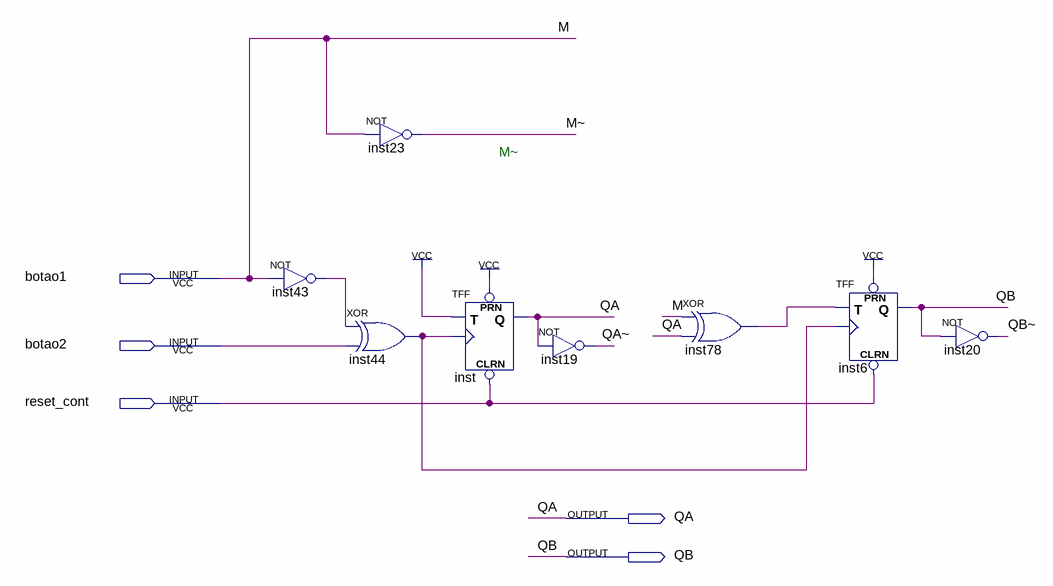
[diagram p0: schematic sheet]
// Quartus schematic Contador2bitsMENU.bdf as structural Verilog: 8 symbols, 5 pins
module Contador2bitsMENU (
  input  botao1,
  input  botao2,
  input  reset_cont,
  output QA,
  output QB
);

  wire inst43_out, inst44_out, inst78_out, \M~ , \QA~ , \QB~ ;

  not inst43 (inst43_out, botao1);
  not inst23 (\M~ , botao1);
  xor inst44 (inst44_out, inst43_out, botao2);
  TFF inst (.PRN(1'b1), .CLRN(reset_cont), .T(1'b1), .CLK(inst44_out), .Q(QA));
  not inst19 (\QA~ , QA);
  xor inst78 (inst78_out, botao1, QA);
  TFF inst6 (.PRN(1'b1), .CLRN(reset_cont), .T(inst78_out), .CLK(inst44_out), .Q(QB));
  not inst20 (\QB~ , QB);

  // Other names for the same wires on the sheet: M = botao1

  // Notes on the sheet:
  //   M~
endmodule
